# Altium schematic sheet 08_DRIVER.SchDoc: =TitleParameter
size A3; Organization: ASISGUARD; Address1: Kemalpasa, Kemalpasa Cd. No:290 D:292H, 35060 Bornova/Izmir/Turkey; SheetNumber: 8; SheetTotal: 8
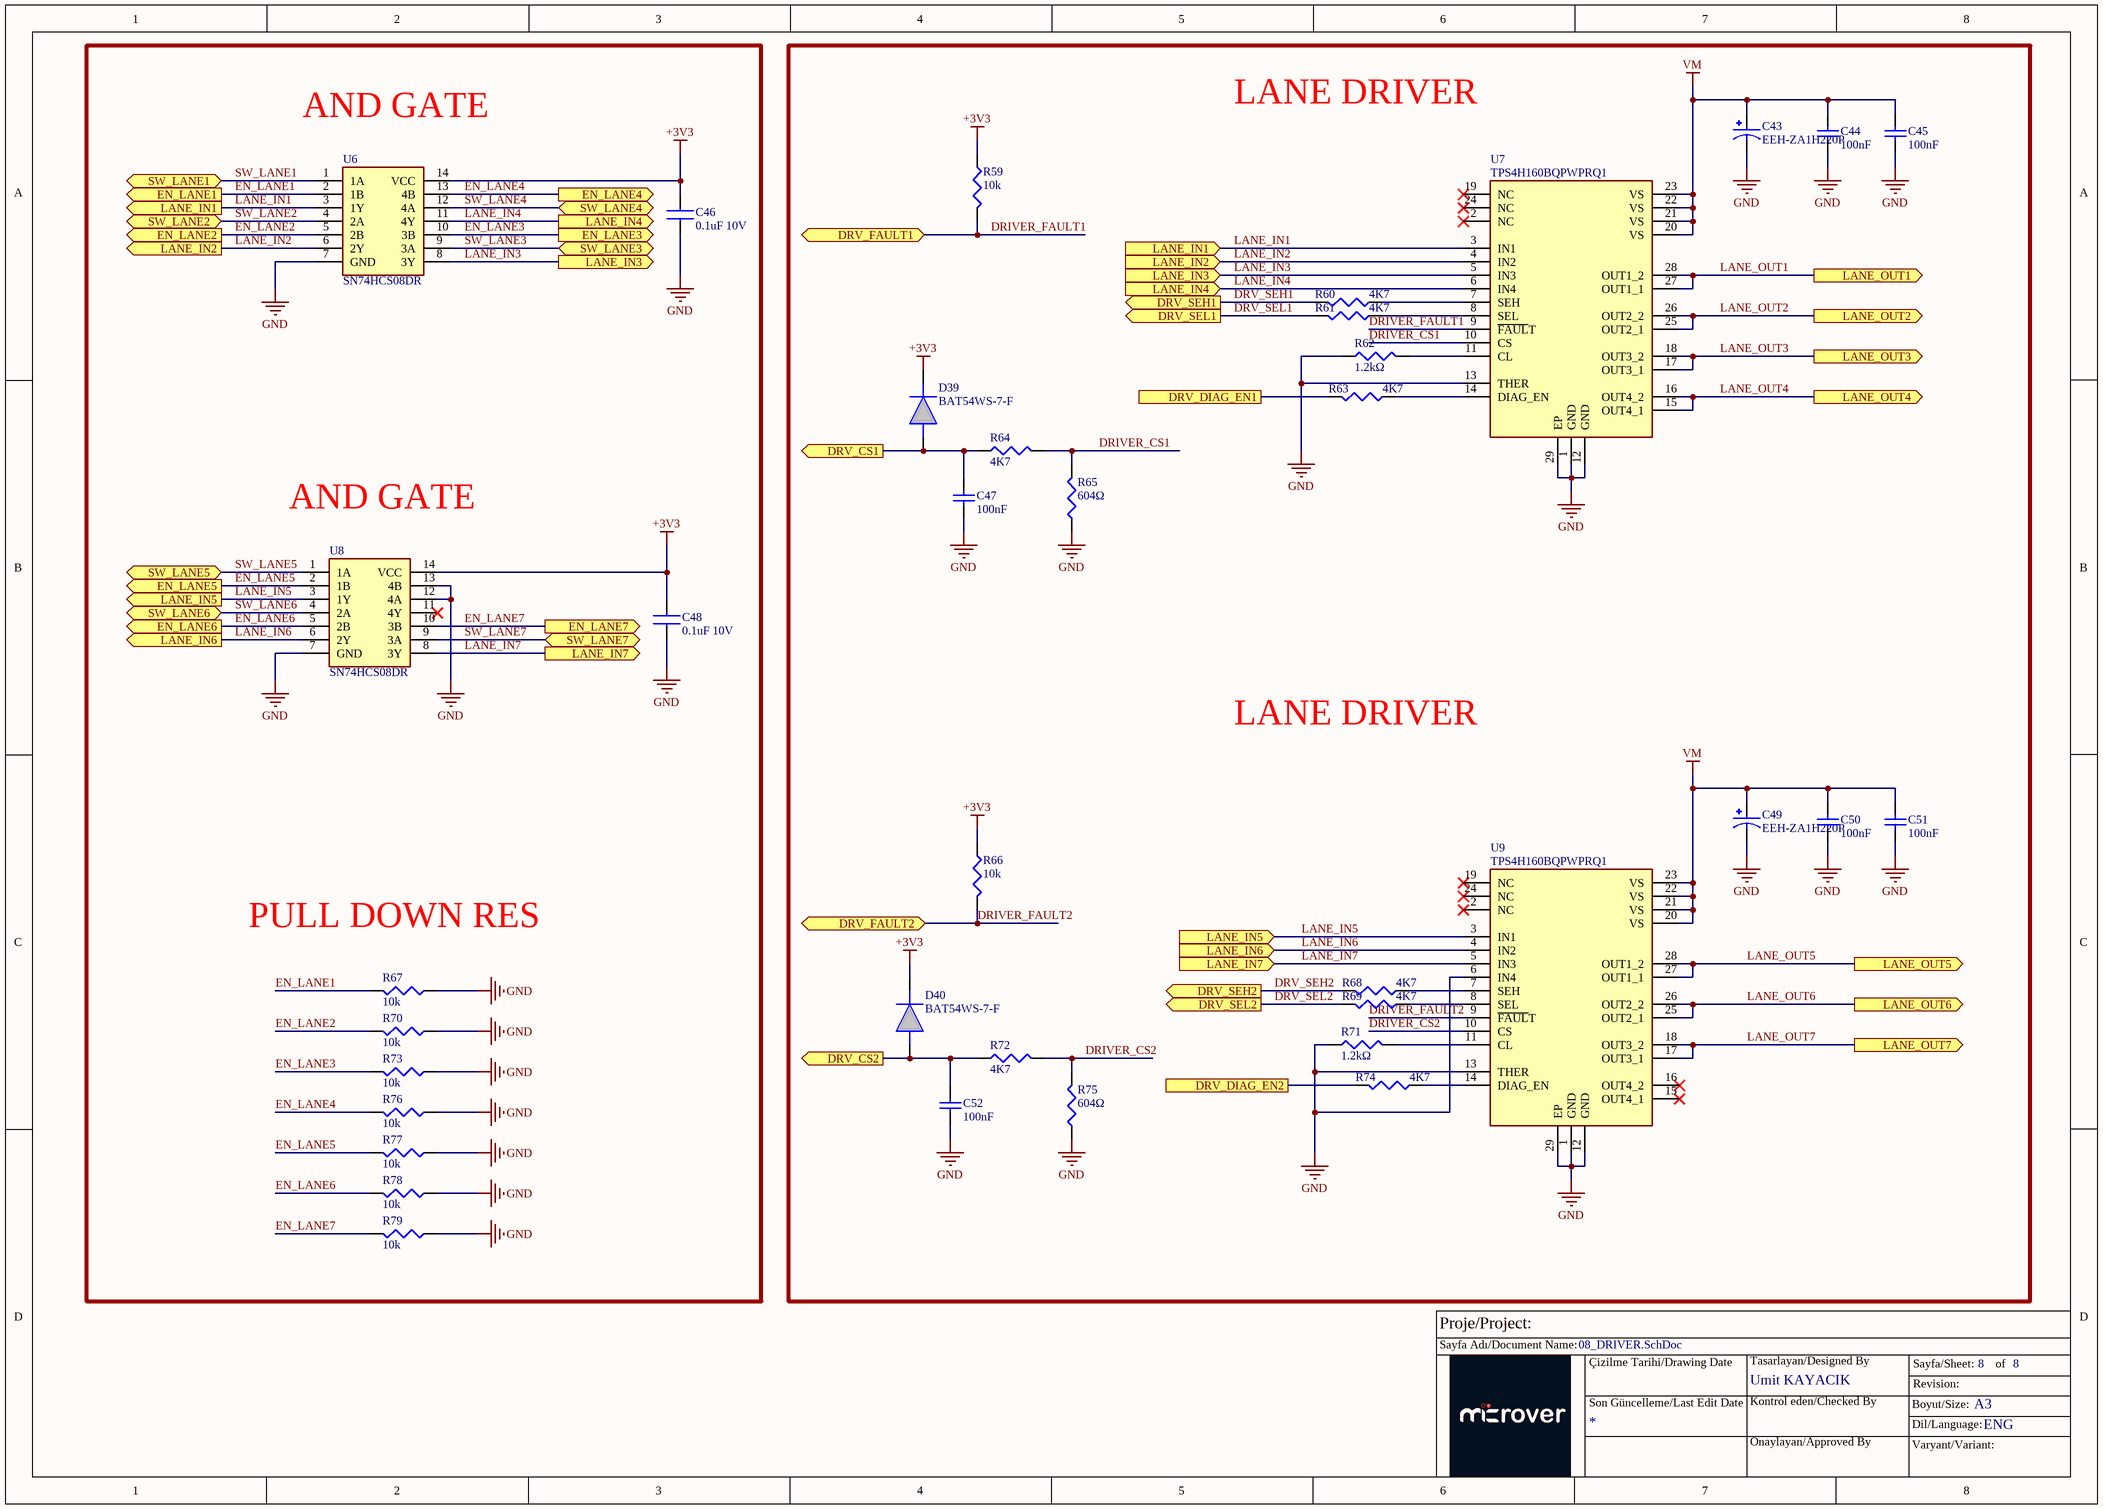
[diagram p0: 08_DRIVER.SchDoc]

## Parts
C43  EEH-ZA1H220P  [CAP_EEHZA1H220P]
C44  100nF  [CAP0603]
C45  100nF  [CAP0603]
C46  0.1uF 10V  [CAP0603]
C47  value 100nF  [CAP0603]  (hidden comment: 100nF 25V)
C48  0.1uF 10V  [CAP0603]
C49  EEH-ZA1H220P  [CAP_EEHZA1H220P]
C50  100nF  [CAP0603]
C51  100nF  [CAP0603]
C52  value 100nF  [CAP0603]  (hidden comment: 100nF 25V)
D39  BAT54WS-7-F  [SOD2513X120N]
D40  BAT54WS-7-F  [SOD2513X120N]
R59  value 10k  [RES0603]  (hidden comment: RES 10K OHM 1% 1/8W 0603)
R60  4K7  [R 0603(1608)]
R61  4K7  [R 0603(1608)]
R62  1.2kΩ  [RES0603]
R63  4K7  [R 0603(1608)]
R64  4K7  [R 0603(1608)]
R65  604Ω  [RES0603]
R66  value 10k  [RES0603]  (hidden comment: RES 10K OHM 1% 1/8W 0603)
R67  value 10k  [RES0603]  (hidden comment: RES 10K OHM 1% 1/8W 0603)
R68  4K7  [R 0603(1608)]
R69  4K7  [R 0603(1608)]
R70  value 10k  [RES0603]  (hidden comment: RES 10K OHM 1% 1/8W 0603)
R71  1.2kΩ  [RES0603]
R72  4K7  [R 0603(1608)]
R73  value 10k  [RES0603]  (hidden comment: RES 10K OHM 1% 1/8W 0603)
R74  4K7  [R 0603(1608)]
R75  604Ω  [RES0603]
R76  value 10k  [RES0603]  (hidden comment: RES 10K OHM 1% 1/8W 0603)
R77  value 10k  [RES0603]  (hidden comment: RES 10K OHM 1% 1/8W 0603)
R78  value 10k  [RES0603]  (hidden comment: RES 10K OHM 1% 1/8W 0603)
R79  value 10k  [RES0603]  (hidden comment: RES 10K OHM 1% 1/8W 0603)
U6  SN74HCS08DR  [SOIC127P600X175-14N]
U7  TPS4H160BQPWPRQ1  [SOP65P640X120-29N]
U8  SN74HCS08DR  [SOIC127P600X175-14N]
U9  TPS4H160BQPWPRQ1  [SOP65P640X120-29N]

## Ports
DRV_CS1 (out), DRV_CS2 (out), DRV_DIAG_EN1, DRV_DIAG_EN2, DRV_FAULT1 (bidir), DRV_FAULT2 (bidir), DRV_SEH1 (out), DRV_SEH2 (out), DRV_SEL1 (out), DRV_SEL2 (out), EN_LANE1 (out), EN_LANE2 (out), EN_LANE3 (out), EN_LANE4 (out), EN_LANE5 (out), EN_LANE6 (out), EN_LANE7 (out), LANE_IN1 (in), LANE_IN1 (out), LANE_IN2 (in), LANE_IN2 (out), LANE_IN3 (in), LANE_IN3 (out), LANE_IN4 (in), LANE_IN4 (out), LANE_IN5 (in), LANE_IN5 (out), LANE_IN6 (in), LANE_IN6 (out), LANE_IN7 (in), LANE_IN7 (out), LANE_OUT1 (out), LANE_OUT2 (out), LANE_OUT3 (out), LANE_OUT4 (out), LANE_OUT5 (out), LANE_OUT6 (out), LANE_OUT7 (out), SW_LANE1 (bidir), SW_LANE2 (bidir), SW_LANE3 (bidir), SW_LANE4 (bidir), SW_LANE5 (bidir), SW_LANE6 (bidir), SW_LANE7 (bidir)

## Nets
+3V3: C46.2 C48.2 D39.1(K) D40.1(K) R59.1 R66.1 U6.14(VCC) U8.14(VCC)
GND: C43.2 C44.1 C45.1 C46.1 C47.1 C48.1 C49.2 C50.1 C51.1 C52.1 R62.1 R65.1 R67.1 R70.1 R71.1 R73.1 R75.1 R76.1 R77.1 R78.1 R79.1 U6.7(GND) U7.1(GND) U7.12(GND) U7.13(THER) U7.29(EP) U8.7(GND) U8.12(4A) U8.13(4B) U9.1(GND) U9.6(IN4) U9.12(GND) U9.13(THER) U9.29(EP)
VM: C43.1 C44.2 C45.2 C49.1 C50.2 C51.2 U7.20(VS) U7.21(VS) U7.22(VS) U7.23(VS) U9.20(VS) U9.21(VS) U9.22(VS) U9.23(VS)
DRIVER_CS1: R64.2 R65.2 U7.10(CS)
DRIVER_CS2: R72.2 R75.2 U9.10(CS)
DRIVER_FAULT1: R59.2 U7.9(~{FAUL}T) ; port DRV_FAULT1
DRIVER_FAULT2: R66.2 U9.9(~{FAUL}T) ; port DRV_FAULT2
DRV_CS1: C47.2 D39.2(A) R64.1 ; port DRV_CS1
DRV_CS2: C52.2 D40.2(A) R72.1 ; port DRV_CS2
DRV_DIAG_EN1: R63.2 ; port DRV_DIAG_EN1
DRV_DIAG_EN2: R74.2 ; port DRV_DIAG_EN2
DRV_SEH1: R60.2 ; port DRV_SEH1
DRV_SEH2: R68.2 ; port DRV_SEH2
DRV_SEL1: R61.2 ; port DRV_SEL1
DRV_SEL2: R69.2 ; port DRV_SEL2
EN_LANE1: R67.2 U6.2(1B) ; port EN_LANE1
EN_LANE2: R70.2 U6.5(2B) ; port EN_LANE2
EN_LANE3: R73.2 U6.10(3B) ; port EN_LANE3
EN_LANE4: R76.2 U6.13(4B) ; port EN_LANE4
EN_LANE5: R77.2 U8.2(1B) ; port EN_LANE5
EN_LANE6: R78.2 U8.5(2B) ; port EN_LANE6
EN_LANE7: R79.2 U8.10(3B) ; port EN_LANE7
LANE_IN1: U6.3(1Y) U7.3(IN1) ; port LANE_IN1
LANE_IN2: U6.6(2Y) U7.4(IN2) ; port LANE_IN2
LANE_IN3: U6.8(3Y) U7.5(IN3) ; port LANE_IN3
LANE_IN4: U6.11(4Y) U7.6(IN4) ; port LANE_IN4
LANE_IN5: U8.3(1Y) U9.3(IN1) ; port LANE_IN5
LANE_IN6: U8.6(2Y) U9.4(IN2) ; port LANE_IN6
LANE_IN7: U8.8(3Y) U9.5(IN3) ; port LANE_IN7
LANE_OUT1: U7.27(OUT1_1) U7.28(OUT1_2) ; port LANE_OUT1
LANE_OUT2: U7.25(OUT2_1) U7.26(OUT2_2) ; port LANE_OUT2
LANE_OUT3: U7.17(OUT3_1) U7.18(OUT3_2) ; port LANE_OUT3
LANE_OUT4: U7.15(OUT4_1) U7.16(OUT4_2) ; port LANE_OUT4
LANE_OUT5: U9.27(OUT1_1) U9.28(OUT1_2) ; port LANE_OUT5
LANE_OUT6: U9.25(OUT2_1) U9.26(OUT2_2) ; port LANE_OUT6
LANE_OUT7: U9.17(OUT3_1) U9.18(OUT3_2) ; port LANE_OUT7
SW_LANE1: U6.1(1A) ; port SW_LANE1
SW_LANE2: U6.4(2A) ; port SW_LANE2
SW_LANE3: U6.9(3A) ; port SW_LANE3
SW_LANE4: U6.12(4A) ; port SW_LANE4
SW_LANE5: U8.1(1A) ; port SW_LANE5
SW_LANE6: U8.4(2A) ; port SW_LANE6
SW_LANE7: U8.9(3A) ; port SW_LANE7
NetR60_1: R60.1 U7.7(SEH)
NetR61_1: R61.1 U7.8(SEL)
NetR62_2: R62.2 U7.11(CL)
NetR63_1: R63.1 U7.14(DIAG_EN)
NetR68_1: R68.1 U9.7(SEH)
NetR69_1: R69.1 U9.8(SEL)
NetR71_2: R71.2 U9.11(CL)
NetR74_1: R74.1 U9.14(DIAG_EN)

Not connected (* = marked no-connect by the designer): U7 2(NC)* 19(NC)* 24(NC)*; U8 11(4Y)*; U9 2(NC)* 15(OUT4_1)* 16(OUT4_2)* 19(NC)* 24(NC)*

## Notes on the sheet
- LANE DRIVER
- AND GATE
- PULL DOWN RES
- Proje/Project:
- Sayfa Adı/Document Name:
- Çizilme Tarihi/Drawing Date
- Umit KAYACIK
- Tasarlayan/Designed By
- Sayfa/Sheet:
- Revision:
- of
- Son Güncelleme/Last Edit Date
- Kontrol eden/Checked By
- Onaylayan/Approved By
- Boyut/Size:
- Varyant/Variant:
- Dil/Language:
- A3
- ENG

## Library data of the parts
C43 C49 = EEH-ZA1H220P: 22 µF 50 V Aluminum - Polymer Capacitors Radial, Can - SMD 80mOhm 10000 Hrs @ 105°C; Manufacturer: Panasonic Industry; MPN: EEH-ZA1H220P
C44 C45 C50 C51 = CAP0603_100nF_1: CAP CER 0.1UF 50V X7R 0603; P/N: C0603C104K5RACTU; Value: 100nF 50V; Order Code: DIGI : 399-5089-1-ND
C46 C48 = CAP0603_0.1uF_10V: 0.1 µF ±10% 10V Ceramic Capacitor X7R 0603 (1608 Metric); Manufacturer Name: AVX; Manufacturer Part Number: 0603ZC104KAT2A; Datasheet Link: https://componentsearchengine.com/Datasheets/1/06031A100FAT2A.pdf; Height: 0.9mm; Mouser Part Number: 581-0603ZC104K; Mouser Price/Stock: https://www.mouser.co.uk/ProductDetail/AVX/0603ZC104KAT2A?qs=pf7pOjfHGZYfu9op9dQPDA%3D%3D; Arrow Part Number: 0603ZC104KAT2A; Arrow Price/Stock: https://www.arrow.com/en/products/0603zc104kat2a/avx
C47 C52 = CAP0603_100nF: 0.1 µF ±10% 50V Ceramic Capacitor X7R 0603 (1608 Metric); Manufacturer Part Number: CL10B104KA8NNNC; LCSC Part Number: C1590
D39 D40 = BAT54WS-7-F: Diode 30 V 100mA Surface Mount SOD-323; MPN: BAT54WS-7-F; Supplier: C124205
R59 R66 R67 R70 R73 R76-R79 = RES0603_10K_%1_1: 10 kOhms ±1% 0.125W, 1/8W Chip Resistor 0603 (1608 Metric) Anti-Sulfur Thin Film; Manufacturer Part Number: RNCP0603FTD10K0; LCSC Manufacturer Part Number: MCT06030C1002FP500; Order Code: Digi: RNCP0603FTD10K0TR-ND; Sirius Stock Code: *; LCSC Part Number: C161803
R60 R61 R63 R64 R68 R69 R72 R74 = Res3_9_1: RES SMD 4.7K OHM 1% 1/10W 0603; Manufacturer: Yageo; Manufacturer Part Number: RC0603FR-074K7L; Resistance: 4.7kR; Temperature Coefficient: 100ppm/°C; Max Power Dissipation: 100mW; Voltage Rating (DC): 50V; ComponentLink1URL: https://datasheet.ciiva.com/11819/0900766b80c66297-11819477.pdf?src-supplier=RSComponents; ComponentLink1Description: https://datasheet.ciiva.com/11819/0900766b80c66297-11819477.pdf?src-supplier=RSComponents; ComponentLink2URL: https://datasheet.ciiva.com/12666/pyu-rc0402-51-rohs-l-6-r-12666741.pdf?src-supplier=Mouser; ComponentLink2Description: https://datasheet.ciiva.com/12666/pyu-rc0402-51-rohs-l-6-r-12666741.pdf?src-supplier=Mouser; ComponentLink3URL: https://datasheet.ciiva.com/17063/pyu-rc0402-51-rohs-l-6-r-17063193.pdf?src-supplier=Future+Electronics; ComponentLink3Description: https://datasheet.ciiva.com/17063/pyu-rc0402-51-rohs-l-6-r-17063193.pdf?src-supplier=Future+Electronics; ComponentLink4URL: https://datasheet.ciiva.com/22747/1018594-22747513.pdf?src-supplier=Element14; ComponentLink4Description: https://datasheet.ciiva.com/22747/1018594-22747513.pdf?src-supplier=Element14; ComponentLink5URL: https://datasheet.ciiva.com/7849/1018594-7849869.pdf?src-supplier=Element14; ComponentLink5Description: https://datasheet.ciiva.com/7849/1018594-7849869.pdf?src-supplier=Element14; ComponentLink6URL: https://datasheet.ciiva.com/7983/1018594-7983502.pdf?src-supplier=Element14; ComponentLink6Description: https://datasheet.ciiva.com/7983/1018594-7983502.pdf?src-supplier=Element14; ComponentLink7URL: https://datasheet.ciiva.com/7849/1018594-7849871.pdf?src-supplier=Element14; ComponentLink7Description: https://datasheet.ciiva.com/7849/1018594-7849871.pdf?src-supplier=Element14; ComponentLink8URL: https://datasheet.ciiva.com/11808/0900766b80c66297-11808195.pdf?src-supplier=RSComponents; ComponentLink8Description: https://datasheet.ciiva.com/11808/0900766b80c66297-11808195.pdf?src-supplier=RSComponents; ComponentLink9URL: https://datasheet.ciiva.com/2452/pyu-rc0402-51-rohs-l-6-2452608.pdf?src-supplier=Digi-Key; ComponentLink9Description: https://datasheet.ciiva.com/2452/pyu-rc0402-51-rohs-l-6-2452608.pdf?src-supplier=Digi-Key; ComponentLink10URL: https://datasheet.ciiva.com/2452/pyu-r-int-thick-7-2452609.pdf?src-supplier=Digi-Key; ComponentLink10Description: https://datasheet.ciiva.com/2452/pyu-r-int-thick-7-2452609.pdf?src-supplier=Digi-Key; ComponentLink11URL: https://datasheet.ciiva.com/2452/pyu-r-int-thick-7-2452610.pdf?src-supplier=Digi-Key; ComponentLink11Description: https://datasheet.ciiva.com/2452/pyu-r-int-thick-7-2452610.pdf?src-supplier=Digi-Key; ComponentLink12URL: https://datasheet.ciiva.com/28386/pyu-rc0402-51-rohs-l-6-28386633.pdf?src-supplier=Avnet+Europe; ComponentLink12Description: https://datasheet.ciiva.com/28386/pyu-rc0402-51-rohs-l-6-28386633.pdf?src-supplier=Avnet+Europe; ComponentLink13URL: https://datasheet.ciiva.com/22747/1018594-22747515.pdf?src-supplier=Element14; ComponentLink13Description: https://datasheet.ciiva.com/22747/1018594-22747515.pdf?src-supplier=Element14; ComponentLink14URL: https://datasheet.ciiva.com/7983/1018594-7983535.pdf?src-supplier=Element14; ComponentLink14Description: https://datasheet.ciiva.com/7983/1018594-7983535.pdf?src-supplier=Element14; ComponentLink15URL: https://datasheet.ciiva.com/8896/pyu-rc0402-51-rohs-l-6-8896201.pdf?src-supplier=Avnet; ComponentLink15Description: https://datasheet.ciiva.com/8896/pyu-rc0402-51-rohs-l-6-8896201.pdf?src-supplier=Avnet; ComponentLink16URL: https://datasheet.ciiva.com/15189/getdatasheetpartid-326379-15189533.pdf?src-supplier=Verical; ComponentLink16Description: https://datasheet.ciiva.com/15189/getdatasheetpartid-326379-15189533.pdf?src-supplier=Verical; ComponentLink17URL: https://datasheet.ciiva.com/11808/0900766b80f96399-11808081.pdf?src-supplier=RSComponents; ComponentLink17Description: https://datasheet.ciiva.com/11808/0900766b80f96399-11808081.pdf?src-supplier=RSComponents; ComponentLink18URL: https://datasheet.ciiva.com/7746/1686128-7746280.pdf?src-supplier=Element14; ComponentLink18Description: https://datasheet.ciiva.com/7746/1686128-7746280.pdf?src-supplier=Element14; ComponentLink19URL: https://datasheet.ciiva.com/7660/1868787-7660790.pdf?src-supplier=Element14; ComponentLink19Description: https://datasheet.ciiva.com/7660/1868787-7660790.pdf?src-supplier=Element14; ComponentLink20URL: https://datasheet.ciiva.com/7983/443971-7983613.pdf?src-supplier=Element14; ComponentLink20Description: https://datasheet.ciiva.com/7983/443971-7983613.pdf?src-supplier=Element14; ComponentLink21URL: https://datasheet.ciiva.com/7746/1738695-7746281.pdf?src-supplier=Element14; ComponentLink21Description: https://datasheet.ciiva.com/7746/1738695-7746281.pdf?src-supplier=Element14; ComponentLink22URL: https://datasheet.ciiva.com/7746/1738695-7746279.pdf?src-supplier=Element14; ComponentLink22Description: https://datasheet.ciiva.com/7746/1738695-7746279.pdf?src-supplier=Element14; ComponentLink23URL: https://datasheet.ciiva.com/8896/pyu-rc0603-51-rohs-l-4-8896106.pdf?src-supplier=Avnet; ComponentLink23Description: https://datasheet.ciiva.com/8896/pyu-rc0603-51-rohs-l-4-8896106.pdf?src-supplier=Avnet; ComponentLink24URL: https://datasheet.ciiva.com/15189/getdatasheetpartid-404327-15189644.pdf?src-supplier=Verical; ComponentLink24Description: https://datasheet.ciiva.com/15189/getdatasheetpartid-404327-15189644.pdf?src-supplier=Verical; ComponentLink25URL: https://datasheet.ciiva.com/28386/pyu-rc0603-51-rohs-l-4-28386648.pdf?src-supplier=Avnet+Europe; ComponentLink25Description: https://datasheet.ciiva.com/28386/pyu-rc0603-51-rohs-l-4-28386648.pdf?src-supplier=Avnet+Europe; ComponentLink26URL: https://datasheet.ciiva.com/25906/pyu-rc0603-51-rohs-l-4-25906933.pdf?src-supplier=Avnet+Europe; ComponentLink26Description: https://datasheet.ciiva.com/25906/pyu-rc0603-51-rohs-l-4-25906933.pdf?src-supplier=Avnet+Europe; Supplier 1: Digi-Key; Supplier Part Number 1: 311-4.70KHRCT-ND; RoHS: Yes; Category: Chip SMD Resistors; Stock 1: 1306882; Pricing 1: 1=0,10000, 10=0,02400, 100=0,00970, 1000=0,00436, 2500=0,00378 (USD); Case/Package: 0603; Number of Pins: 2; Case Code (Imperial): 0603; Case Code (Metric): 1608; Size Code: 0603; Min Operating Temperature: -55°C; Max Operating Temperature: 155°C; Packaging: Tape and Reel; Tolerance: 1%; Resistor Type: Thick Film; Series: RC; Number of Terminations: 2; Features: Moisture Resistant; Power Rating: 100mW; Voltage Rating: 50V; Termination: SMD/SMT; Construction: Rectangular; Resistance Tolerance: 1%; Length: 1.6mm; Width: 0.8mm; Height: 0.45mm; Depth: 0.8mm; Lead Pitch: 0.3mm; RoHS Compliant: Yes; Lead Free: Lead Free; Military Standard: Not; REACH SVHC: No SVHC; ComponentLink27URL: https://datasheet.ciiva.com/15189/getdatasheetpartid-422754-15189760.pdf?src-supplier=Verical; ComponentLink27Description: https://datasheet.ciiva.com/15189/getdatasheetpartid-422754-15189760.pdf?src-supplier=Verical; ComponentLink28URL: https://datasheet.ciiva.com/22747/443971-22747528.pdf?src-supplier=Element14; ComponentLink28Description: https://datasheet.ciiva.com/22747/443971-22747528.pdf?src-supplier=Element14; ComponentLink29URL: https://datasheet.ciiva.com/7660/38590-7660794.pdf?src-supplier=Element14; ComponentLink29Description: https://datasheet.ciiva.com/7660/38590-7660794.pdf?src-supplier=Element14; ComponentLink30URL: https://datasheet.ciiva.com/7746/1868787-7746365.pdf?src-supplier=Element14; ComponentLink30Description: https://datasheet.ciiva.com/7746/1868787-7746365.pdf?src-supplier=Element14; ComponentLink31URL: https://datasheet.ciiva.com/46440/1868787-46440909.pdf?src-supplier=Element14; ComponentLink31Description: https://datasheet.ciiva.com/46440/1868787-46440909.pdf?src-supplier=Element14; ComponentLink32URL: https://datasheet.ciiva.com/7746/1738695-7746366.pdf?src-supplier=Element14; ComponentLink32Description: https://datasheet.ciiva.com/7746/1738695-7746366.pdf?src-supplier=Element14
R62 R71 = 0603WAF1201T5E: -55℃~+155℃ 1.2kΩ 100mW 75V Thick Film Resistor ±1% ±100ppm/℃ 0603 Chip Resistor - Surface Mount ROHS; Manifacturer: UNI-ROYAL(Uniroyal Elec); JLCPCB PART#: C22765
R65 R75 = 0603WAF6040T5E: -55℃~+155℃ 100mW 604Ω 75V Thick Film Resistor ±1% ±100ppm/℃ 0603 Chip Resistor - Surface Mount ROHS
U6 U8 = SN74HCS08DR: AND Gate IC 4 Channel Schmitt Trigger Input 14-SOIC; MPN: SN74HCS08DR
U7 U9 = TPS4H160BQPWPRQ1: 40-V, 160-mΩ, 4-ch automotive smart high-side switch with adjustable current limit; MPN: TPS4H160-Q1; Supplier: 595-TPS4H160BQPWPRQ1